# EAGLE design Mixer (EAGLE 9.2.2)
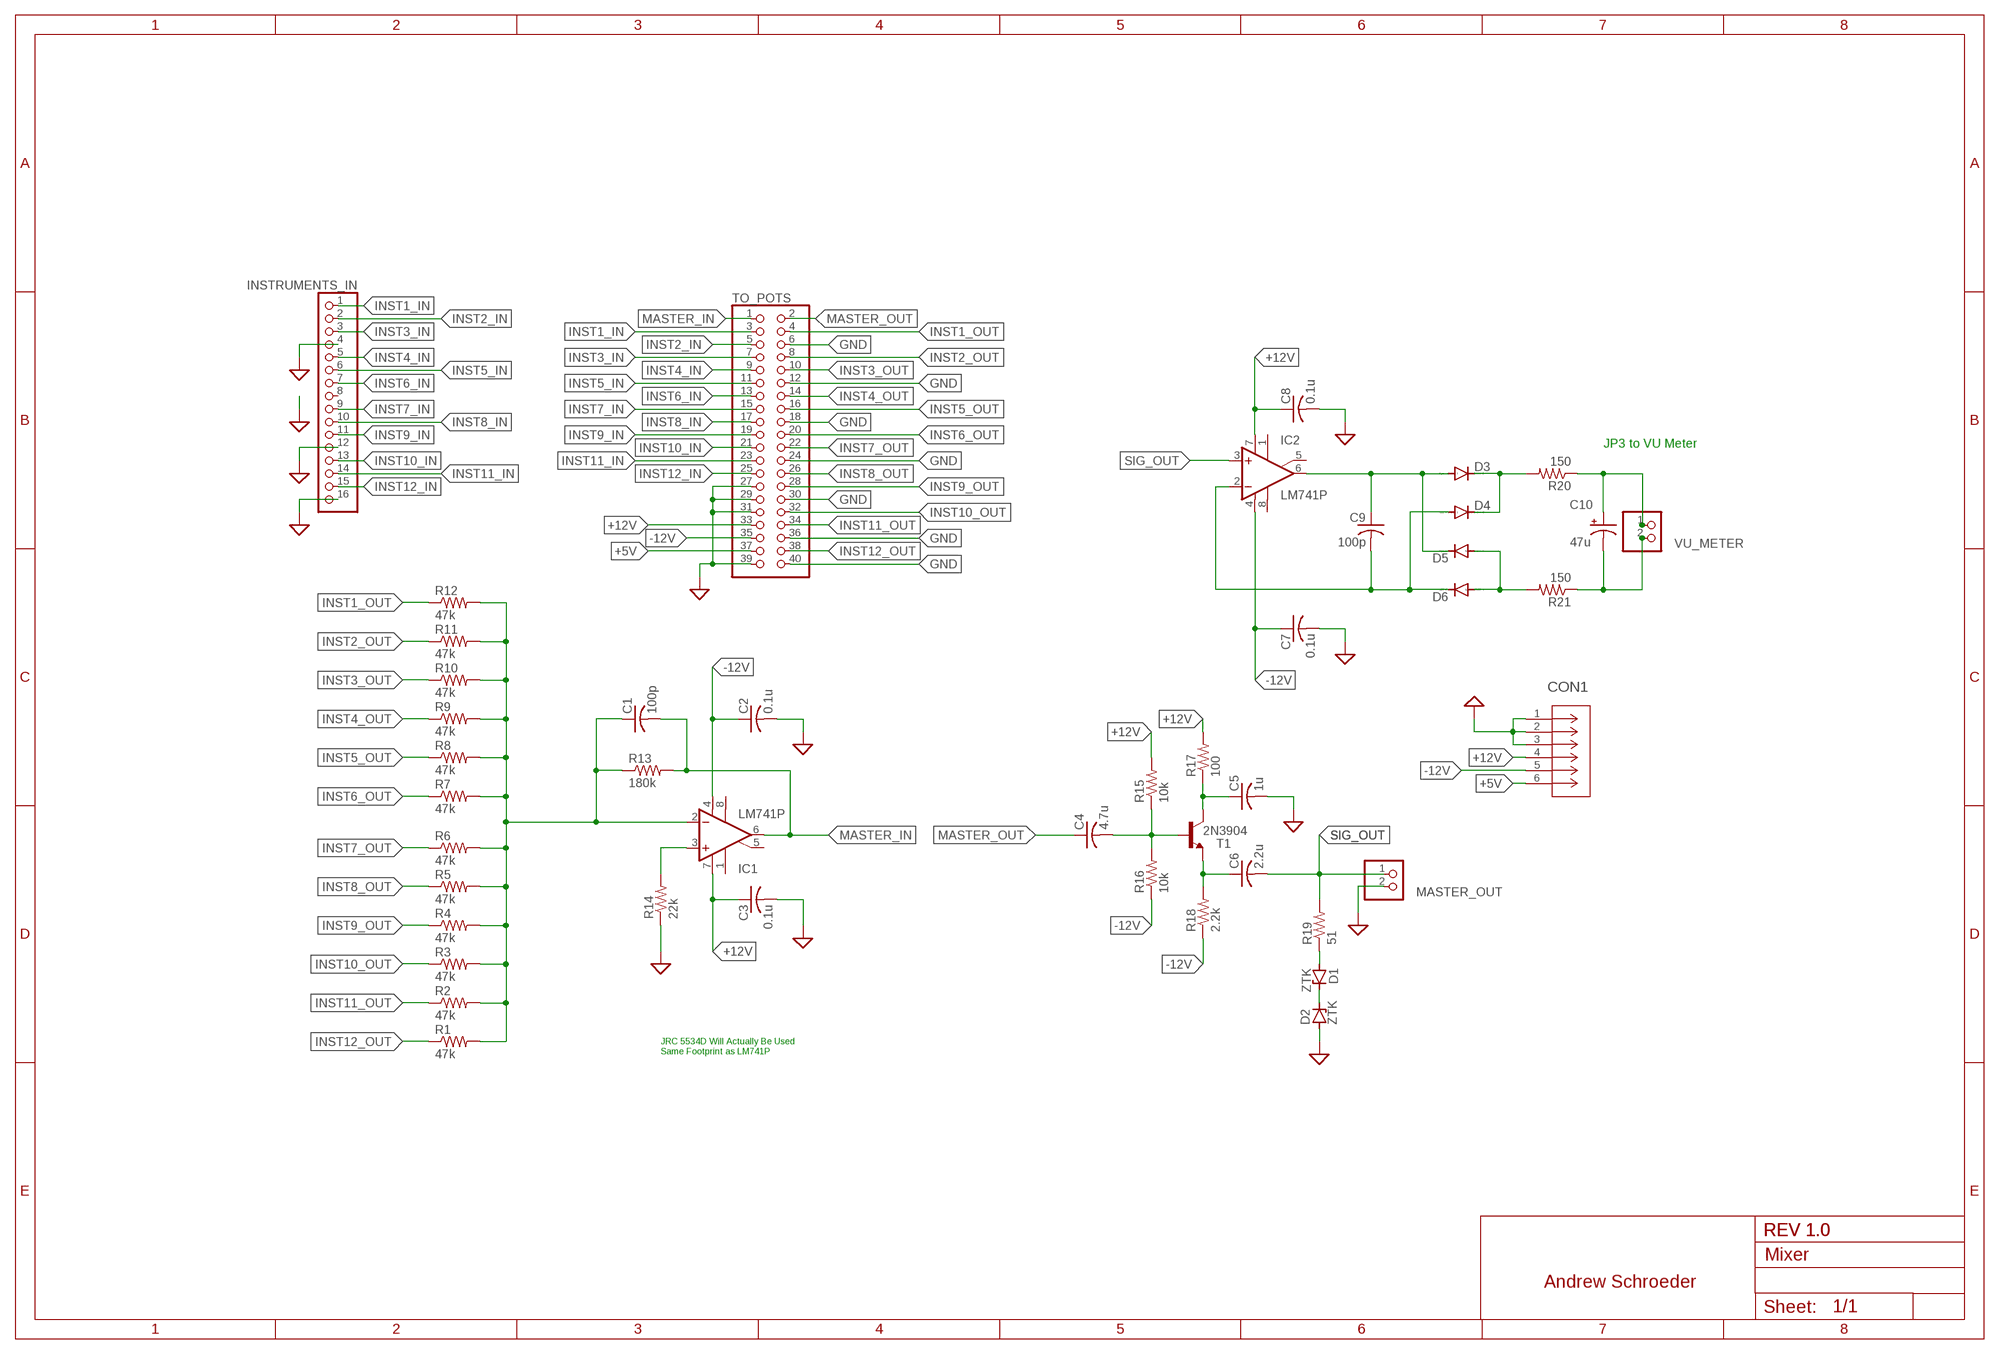
[diagram p0: schematic, sheet 1]

## Parts
C1  100p  C-US025-025X050  [C025-025X050]
C2  0.1u  C-US025-025X050  [C025-025X050]
C3  0.1u  C-US025-025X050  [C025-025X050]
C4  4.7u  C-US025-025X050  [C025-025X050]
C5  1u  C-US025-025X050  [C025-025X050]
C6  2.2u  C-US025-025X050  [C025-025X050]
C7  0.1u  C-US025-025X050  [C025-025X050]
C8  0.1u  C-US025-025X050  [C025-025X050]
C9  100p  C-US025-025X050  [C025-025X050]
C10  47u  CPOL-USE2-5  [E2-5]
CON1  1-770875-01-770875-0_VERTICAL  [1-770875-0]
D1  ZTK  [DO35Z10]
D2  ZTK  [DO35Z10]
D3  1N4148DO35-7  [DO35-7]
D4  1N4148DO35-7  [DO35-7]
D5  1N4148DO35-7  [DO35-7]
D6  1N4148DO35-7  [DO35-7]
IC1  LM741P  [DIL08]
IC2  LM741P  [DIL08]
INSTRUMENTS_IN  PINHD-1X16  [1X16]
MASTER_OUT  PINHD-1X2  [1X02]
R1  47k  R-US_0207/7  [0207/7]
R2  47k  R-US_0207/7  [0207/7]
R3  47k  R-US_0207/7  [0207/7]
R4  47k  R-US_0207/7  [0207/7]
R5  47k  R-US_0207/7  [0207/7]
R6  47k  R-US_0207/7  [0207/7]
R7  47k  R-US_0207/7  [0207/7]
R8  47k  R-US_0207/7  [0207/7]
R9  47k  R-US_0207/7  [0207/7]
R10  47k  R-US_0207/7  [0207/7]
R11  47k  R-US_0207/7  [0207/7]
R12  47k  R-US_0207/7  [0207/7]
R13  180k  R-US_0207/7  [0207/7]
R14  22k  R-US_0207/7  [0207/7]
R15  10k  R-US_0207/7  [0207/7]
R16  10k  R-US_0207/7  [0207/7]
R17  100  R-US_0207/7  [0207/7]
R18  2.2k  R-US_0207/7  [0207/7]
R19  51  R-US_0207/7  [0207/7]
R20  150  R-US_0207/7  [0207/7]
R21  150  R-US_0207/7  [0207/7]
T1  2N3904  [TO92]
TO_POTS  PINHD-2X20  [2X20]
VU_METER  PINHD-1X2  [1X02]

## Nets
+5V: CON1.6 TO_POTS.37
+12V: C3.1 C8.1 CON1.4 IC1.7(V+) IC2.7(V+) R15.2 R17.2 TO_POTS.33
-12V: C2.1 C7.1 CON1.5 IC1.4(V-) IC2.4(V-) R16.1 R18.1 TO_POTS.35
GND: C2.2 C3.2 C5.2 C7.2 C8.2 CON1.1 CON1.2 CON1.3 D2.A INSTRUMENTS_IN.4 INSTRUMENTS_IN.12 INSTRUMENTS_IN.16 MASTER_OUT.2 R14.1 TO_POTS.6 TO_POTS.12 TO_POTS.18 TO_POTS.24 TO_POTS.27 TO_POTS.29 TO_POTS.30 TO_POTS.31 TO_POTS.36 TO_POTS.39 TO_POTS.40 ; supply symbol labelled SUP
INST1_IN: INSTRUMENTS_IN.1 TO_POTS.3
INST1_OUT: R12.1 TO_POTS.4
INST2_IN: INSTRUMENTS_IN.2 TO_POTS.5
INST2_OUT: R11.1 TO_POTS.8
INST3_IN: INSTRUMENTS_IN.3 TO_POTS.7
INST3_OUT: R10.1 TO_POTS.10
INST4_IN: INSTRUMENTS_IN.5 TO_POTS.9
INST4_OUT: R9.1 TO_POTS.14
INST5_IN: INSTRUMENTS_IN.6 TO_POTS.11
INST5_OUT: R8.1 TO_POTS.16
INST6_IN: INSTRUMENTS_IN.7 TO_POTS.13
INST6_OUT: R7.1 TO_POTS.20
INST7_IN: INSTRUMENTS_IN.9 TO_POTS.15
INST7_OUT: R6.1 TO_POTS.22
INST8_IN: INSTRUMENTS_IN.10 TO_POTS.17
INST8_OUT: R5.1 TO_POTS.26
INST9_IN: INSTRUMENTS_IN.11 TO_POTS.19
INST9_OUT: R4.1 TO_POTS.28
INST10_IN: INSTRUMENTS_IN.13 TO_POTS.21
INST10_OUT: R3.1 TO_POTS.32
INST11_IN: INSTRUMENTS_IN.14 TO_POTS.23
INST11_OUT: R2.1 TO_POTS.34
INST12_IN: INSTRUMENTS_IN.15 TO_POTS.25
INST12_OUT: R1.1 TO_POTS.38
MASTER_IN: C1.2 IC1.6(OUT) R13.2 TO_POTS.1
MASTER_OUT: C4.1 TO_POTS.2
N$1: C9.1 D3.A D5.C IC2.6(OUT)
N$2: IC1.3(+IN) R14.2
N$3: C9.2 D4.A D6.C IC2.2(-IN)
N$4: C1.1 IC1.2(-IN) R1.2 R2.2 R3.2 R4.2 R5.2 R6.2 R7.2 R8.2 R9.2 R10.2 R11.2 R12.2 R13.1
N$5: D5.A D6.A R21.2
N$6: C4.2 R15.1 R16.2 T1.2(B)
N$7: C10.+ R20.1 VU_METER.1
N$8: C5.1 R17.1 T1.1(C)
N$9: D3.C D4.C R20.2
N$10: C6.1 R18.2 T1.3(E)
N$11: C10.- R21.1 VU_METER.2
N$12: D1.A R19.1
N$16: D1.C D2.C
SIG_OUT: C6.2 IC2.3(+IN) MASTER_OUT.1 R19.2
Unconnected: IC1.1(ON1) IC1.5(ON2) IC1.8(OPT) IC2.1(ON1) IC2.5(ON2) IC2.8(OPT) INSTRUMENTS_IN.8

## Notes on the sheet
- JP3 to VU Meter
- JRC 5534D Will Actually Be Used
  Same Footprint as LM741P
- REV 1.0 | REV 1.0
- Andrew Schroeder

## Library data of the parts
C1-C9 = rcl:C-US: CAPACITOR, American symbol; SPICEPREFIX: C
C10 = rcl:CPOL-US: POLARIZED CAPACITOR, American symbol; SPICEPREFIX: C
CON1 = Capstone:1-770875-0
D1 D2 = diode:ZTK: Z DIODE
D3-D6 = diode:1N4148: DIODE high speed (Philips)
IC1 IC2 = linear:*741: OP AMP
INSTRUMENTS_IN = pinhead:PINHD-1X16: PIN HEADER
MASTER_OUT VU_METER = pinhead:PINHD-1X2: PIN HEADER
R1-R21 = rcl:R-US_: RESISTOR, American symbol; SPICEPREFIX: R
T1 = transistor:2N3904: NPN TRANSISTOR
TO_POTS = pinhead:PINHD-2X20: PIN HEADER

## Board
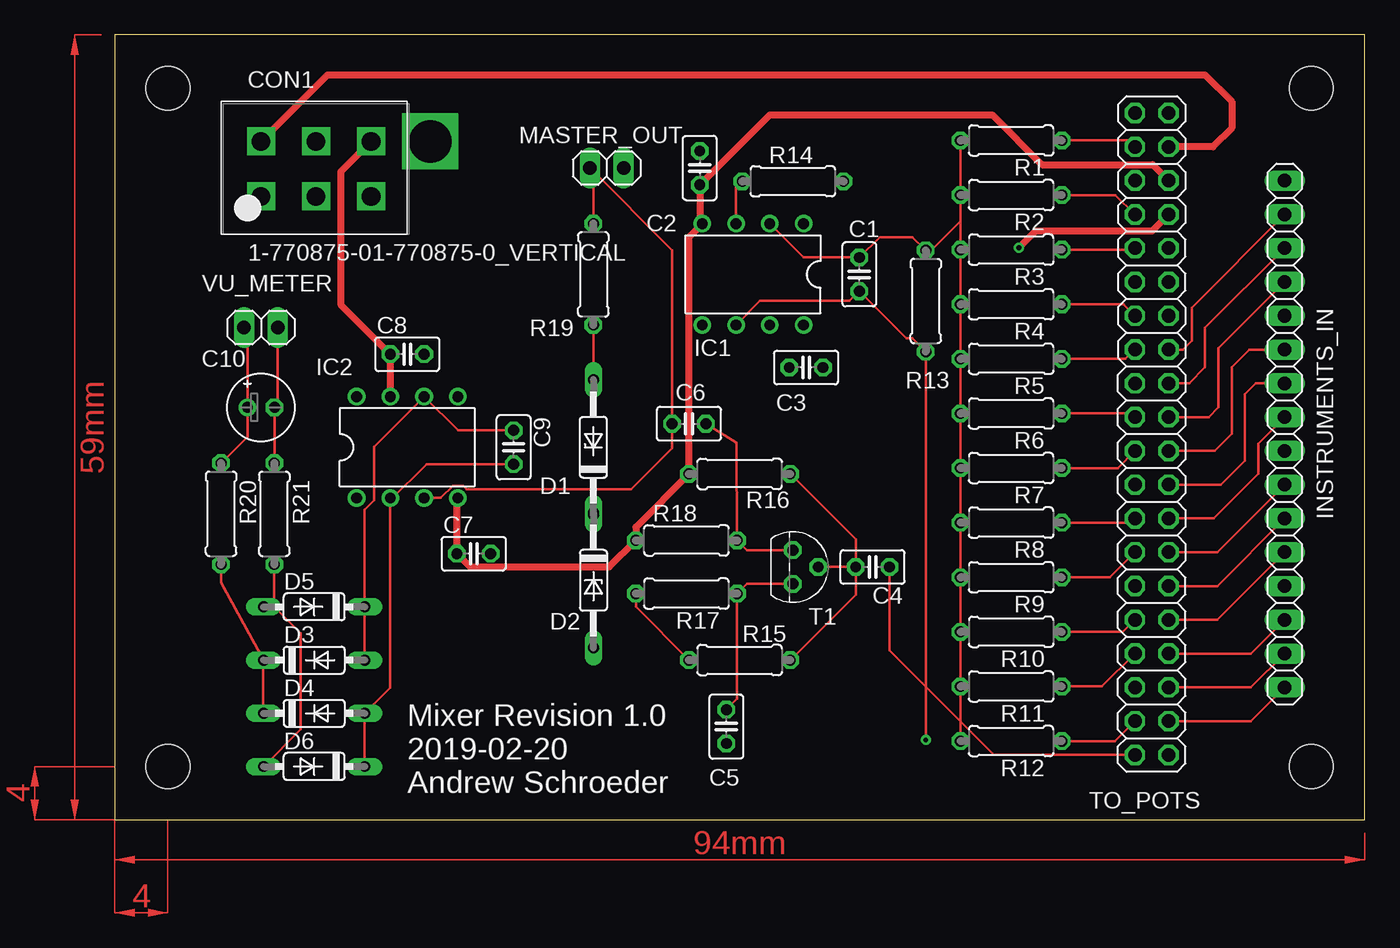
[diagram p1: board, top side]
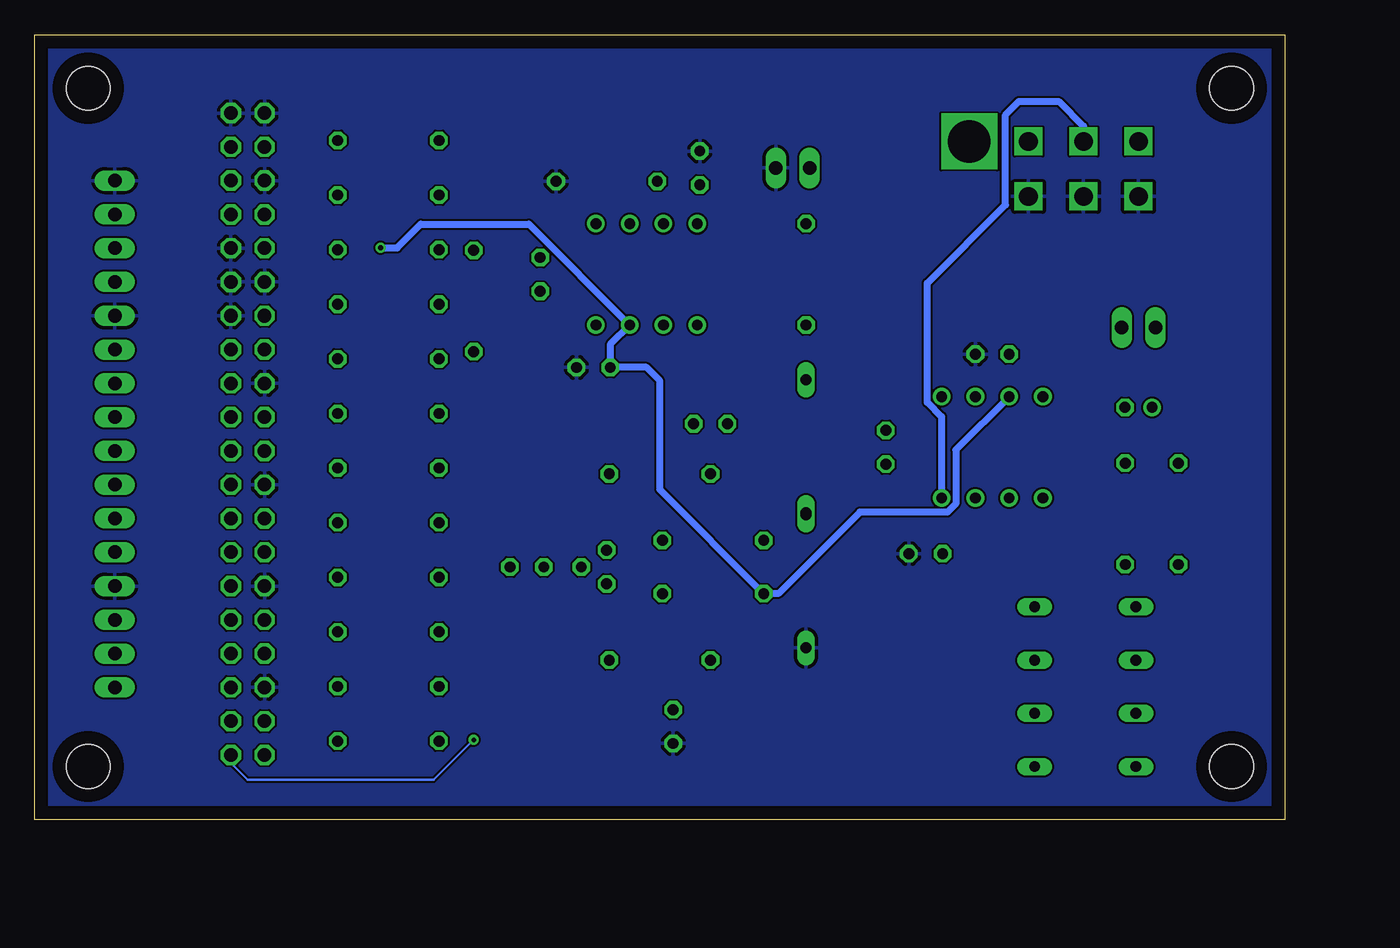
[diagram p2: board, bottom side, seen from below]

Size 94 x 59 mm. Coordinates in mm from the lower left corner, seen from the top.
Outline: 0,0 94,0 94,59 0,59 0,0
Copper layers (1*16): Top 0.035mm / dielectric 1.5mm / Bottom 0.035mm
Design rules "default": minimum track width 6mil, minimum drill 0.35mm, track to track 6mil, track to pad 6mil, pad to pad 6mil, via to via 6mil, smd to smd 6mil, copper to edge 40mil, drill to drill 6mil, minimum pad ring 10mil, minimum via ring 8mil, stop-mask expansion 4mil, vias tented up to drill 0mil, thermal gap 10mil

### Footprints (pad centres in the part's own frame; a part is rotated, then mirrored left to right if it is on the bottom)
C025-025X050 = drill 0.813 octagon: 1 -1.27,0; 2 1.27,0
E2-5 = drill 0.813 pad 1.27: + -1.016,0 | drill 0.813 pad 1.27 octagon: - 1.016,0
1-770875-0 = drill 1.4 square: 1 8.28,-4.14; 2 4.14,-4.14; 3 0,-4.14; 4 8.28,0; 5 4.14,0; 6 0,0 | drill 3.18 square: NULL 12.73,0
DO35Z10 = drill 0.813 long: A 5.08,0; C -5.08,0
DO35-7 = drill 0.813 long: A 3.81,0; C -3.81,0
DIL08 = drill 0.813 pad 1.27: 1 -3.81,-3.81; 2 -1.27,-3.81; 3 1.27,-3.81; 4 3.81,-3.81; 5 3.81,3.81; 6 1.27,3.81; 7 -1.27,3.81; 8 -3.81,3.81
1X16 = drill 1.016 long: 1 -19.05,0; 2 -16.51,0; 3 -13.97,0; 4 -11.43,0; 5 -8.89,0; 6 -6.35,0; 7 -3.81,0; 8 -1.27,0; 9 1.27,0; 10 3.81,0; 11 6.35,0; 12 8.89,0; 13 11.43,0; 14 13.97,0; 15 16.51,0; 16 19.05,0
1X02 = drill 1.016 long: 1 -1.27,0; 2 1.27,0
0207/7 = drill 0.813 octagon: 1 -3.81,0; 2 3.81,0
TO92 = drill 0.813 octagon: 1 1.27,0; 2 0,1.905; 3 -1.27,0
2X20 = drill 1.016 octagon: 1 -24.13,-1.27; 2 -24.13,1.27; 3 -21.59,-1.27; 4 -21.59,1.27; 5 -19.05,-1.27; 6 -19.05,1.27; 7 -16.51,-1.27; 8 -16.51,1.27; 9 -13.97,-1.27; 10 -13.97,1.27; 11 -11.43,-1.27; 12 -11.43,1.27; 13 -8.89,-1.27; 14 -8.89,1.27; 15 -6.35,-1.27; 16 -6.35,1.27; 17 -3.81,-1.27; 18 -3.81,1.27; 19 -1.27,-1.27; 20 -1.27,1.27; 21 1.27,-1.27; 22 1.27,1.27; 23 3.81,-1.27; 24 3.81,1.27; 25 6.35,-1.27; 26 6.35,1.27; 27 8.89,-1.27; 28 8.89,1.27; 29 11.43,-1.27; 30 11.43,1.27; 31 13.97,-1.27; 32 13.97,1.27; 33 16.51,-1.27; 34 16.51,1.27; 35 19.05,-1.27; 36 19.05,1.27; 37 21.59,-1.27; 38 21.59,1.27; 39 24.13,-1.27; 40 24.13,1.27
STAND-OFF = hole 3.302: 0,0

### Placement (x,y rotation side)
C1  56,41 270 top
C2  44,49 90 top
C3  52,34 0 top
C4  57,19 180 top
C5  46,7 270 top
C6  43.19,29.77 180 top
C7  27,20 0 top
C8  22,35 0 top
C9  30,28 270 top
C10  11,31 0 top
CON1  11,51 0 top
D1  36,28 90 top
D2  36,18 270 top
D3  15,12 0 top
D4  15,8 0 top
D5  15,16 180 top
D6  15,4 180 top
IC1  48,41 180 top
IC2  22,28 0 top
INSTRUMENTS_IN  88,29 90 top
MASTER_OUT  37,49 0 top
R1  67.42,51.07 180 top
R2  67.42,46.96 180 top
R3  67.42,42.86 180 top
R4  67.42,38.75 180 top
R5  67.42,34.65 180 top
R6  67.42,30.54 180 top
R7  67.42,26.44 180 top
R8  67.42,22.33 180 top
R9  67.42,18.23 180 top
R10  67.42,14.12 180 top
R11  67.42,10.02 180 top
R12  67.42,5.91 180 top
R13  61,39 270 top
R14  51,48 180 top
R15  47,12 180 top
R16  47,26 0 top
R17  43,17 180 top
R18  43,21 0 top
R19  36,41 90 top
R20  8,23 270 top
R21  12,23 270 top
T1  51,19 270 top
TO_POTS  78,29 90 top
U$1  [STAND-OFF]  4,4 0 top
U$2  [STAND-OFF]  90,55 0 top
U$3  [STAND-OFF]  4,55 0 top
U$4  [STAND-OFF]  90,4 0 top
U$5  [A4L-LOC]  -83,-58 0 top  (outside the outline)
VU_METER  11,37 0 top

### Tracks (layer width: path | path; a pad name or v marks a point on that pad's centre or on a via)
+5V
  Top 0.508: TO_POTS.37 82.59,50.59 84,52 84,54 82,56 16,56 CON1.6
+12V  (via drill 0.35)
  Top 0.2: R15.2 39.19,16 R17.2
  Top 0.508: TO_POTS.33 78.01,44.25 69.25,44.25 v68,43 | IC2.7 C8.1 17,38.73 17,48.72 CON1.4
  Bottom 0.508: v68,43 66.76,43 64.99,44.77 56.85,44.77 IC1.7 50.73,35.73 C3.1 48,34 47,33 47,24.81 R17.2 38.09,17 31.97,23.12 25.37,23.12 24.74,23.75 24.74,27.8 IC2.7
-12V
  Top 0.2: 44,45 IC1.4
  Top 0.508: 44,45 C2.1 49.27,53 66,53 69.75,49.25 78.07,49.25 TO_POTS.35 | IC1.4 43.19,43.81 R16.1 39.19,22 R18.1 37.19,19 26.73,19 C7.1 25.73,24.11 IC2.4
  Bottom 0.508: IC2.4 25.81,30.3 26.88,31.37 26.88,40.34 21,46.22 21,53 20,54 17,54 15.14,52.14 CON1.5
GND
  pour Bottom: -1,60 95,60 95,-1 -1,-1
INST1_IN
  Top 0.2: INSTRUMENTS_IN.1 85.46,7.41 TO_POTS.3
INST1_OUT
  Top 0.2: R12.1 75.23,5.91 TO_POTS.4
INST2_IN
  Top 0.2: INSTRUMENTS_IN.2 85.46,9.95 TO_POTS.5
INST2_OUT
  Top 0.2: R11.1 74.25,10.02 TO_POTS.8
INST3_IN
  Top 0.2: INSTRUMENTS_IN.3 85.46,12.49 TO_POTS.7
INST3_OUT
  Top 0.2: R10.1 75.82,14.12 TO_POTS.10
INST4_IN
  Top 0.2: INSTRUMENTS_IN.5 82.92,15.03 TO_POTS.9
INST4_OUT
  Top 0.2: R9.1 74.85,18.23 TO_POTS.14
INST5_IN
  Top 0.2: INSTRUMENTS_IN.6 82.92,17.57 TO_POTS.11
INST5_OUT
  Top 0.2: R8.1 76.41,22.33 TO_POTS.16
INST6_IN
  Top 0.2: INSTRUMENTS_IN.7 82.92,20.11 TO_POTS.13
INST6_OUT
  Top 0.2: R7.1 75.44,26.44 TO_POTS.20
INST7_IN
  Top 0.2: 87,30 87.73,30 INSTRUMENTS_IN.9 86,28.27 86,26 82.65,22.65 TO_POTS.15
INST7_OUT
  Top 0.2: R6.1 76.46,30.54 TO_POTS.22
INST8_IN
  Top 0.2: INSTRUMENTS_IN.10 85.81,32.81 85,32 85,27 83.19,25.19 TO_POTS.17
INST8_OUT
  Top 0.2: R5.1 76.03,34.65 TO_POTS.26
INST9_IN
  Top 0.2: TO_POTS.19 82.73,27.73 84,29 84,34 85.35,35.35 INSTRUMENTS_IN.11
INST9_OUT
  Top 0.2: R4.1 75.87,38.75 TO_POTS.28
INST10_IN
  Top 0.2: INSTRUMENTS_IN.13 83,35.43 83,31 82.27,30.27 TO_POTS.21
INST10_OUT
  Top 0.2: R3.1 76.62,42.86 TO_POTS.32
INST11_IN
  Top 0.2: INSTRUMENTS_IN.14 82,36.97 82,34 80.81,32.81 TO_POTS.23
INST11_OUT
  Top 0.2: R2.1 75.28,46.97 TO_POTS.34
INST12_IN
  Top 0.2: 87,45.51 INSTRUMENTS_IN.15 81,38.51 81,36 80.35,35.35 TO_POTS.25
INST12_OUT
  Top 0.2: R1.1 76.25,51.07 TO_POTS.38
MASTER_IN  (via drill 0.35)
  Top 0.2: IC1.6 48.54,39 55.27,39 C1.2 59.54,36.19 60,36.19 R13.2 v61,6
  Bottom 0.2: v61,6 64,3 78,3 79.27,4.27 TO_POTS.1
MASTER_OUT
  Top 0.2: TO_POTS.2 66.13,4.87 58.27,12.73 C4.1
N$1
  Top 0.2: D3.A D5.C 18.81,23.31 19.5,24 19.5,28.04 IC2.6 25.81,29.27 C9.1
N$2
  Top 0.2: R14.2 46.73,47.54 IC1.3
N$3
  Top 0.2: D6.C D4.A 20.73,9.92 20.73,24 | 20.73,24 IC2.2 | C9.2 23.46,26.73 20.73,24
N$4
  Top 0.2: R1.2 R2.2 63.61,45 | 63.61,45 R3.2 R4.2 R5.2 R6.2 R7.2 R8.2 R9.2 R10.2 R11.2 R12.2 | 63.61,45 61.42,42.81 R13.1 60,43.81 57.54,43.81 C1.1 51.81,42.27 IC1.2
N$5
  Top 0.2: R21.2 12,16.09 D5.A 12,16 14,14 14,6.81 D6.A
N$6
  Top 0.2: C4.2 55.73,21.08 R16.2 | C4.2 55.73,16.92 R15.1 | C4.2 T1.2
N$7
  Top 0.2: VU_METER.1 9.98,36.75 C10.+ 9.98,28.79 R20.1
N$8
  Top 0.2: T1.1 47.54,17.73 R17.1 46.81,9.08 C5.1
N$9
  Top 0.2: R20.2 8,17.81 11.15,12.08 | 11.15,12.08 D3.C | D4.C 11.15,8.04 11.15,12.08
N$10
  Top 0.2: T1.3 47.54,20.27 R18.2 46.75,28.35 C6.1
N$11
  Top 0.2: VU_METER.2 12.27,31.25 C10.- 12.02,26.83 R21.1
N$12
  Top 0.2: R19.1 D1.A
N$16
  Top 0.2: D1.C D2.C
SIG_OUT
  Top 0.2: R19.2 36,48.73 MASTER_OUT.1 41.92,42.81 C6.2 41.92,27.92 38.84,24.84 26.45,24.84 26.19,25.1 25.43,25.1 24.52,24.19 IC2.3
(copper drawn outside any net)
  shapes: Top area x4

### Text on the board
tNames: Mixer Revision 1.0 / 2019-02-20 / Andrew Schroeder
Document: Andrew Schroeder | Revision 1.0